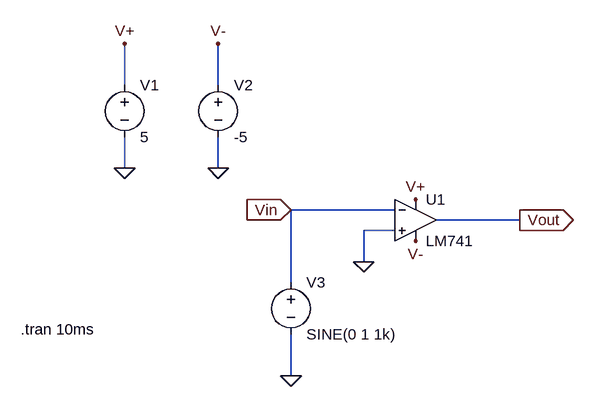
[diagram p0: schematic OPAmp-1.asc]
OPAmp-1.asc, the LTspice schematic file:
Version 4
SHEET 1 880 680
WIRE 48 144 48 80
WIRE 192 144 192 80
WIRE 48 272 48 224
WIRE 192 272 192 224
WIRE 464 336 304 336
WIRE 656 352 528 352
WIRE 464 368 416 368
WIRE 416 416 416 368
WIRE 304 448 304 336
WIRE 304 592 304 528
FLAG 48 272 0
FLAG 192 272 0
FLAG 304 336 Vin
IOPIN 304 336 In
FLAG 416 416 0
FLAG 304 592 0
FLAG 656 352 Vout
IOPIN 656 352 Out
FLAG 496 320 V+
FLAG 496 384 V-
FLAG 192 80 V-
FLAG 48 80 V+
SYMBOL LM741 496 288 R0
SYMATTR InstName U1
SYMBOL voltage 48 128 R0
SYMATTR InstName V1
SYMATTR Value 5
SYMBOL voltage 192 128 R0
SYMATTR InstName V2
SYMATTR Value -5
SYMBOL Voltage 304 432 R0
SYMATTR InstName V3
SYMATTR Value SINE(0 1 1k)
TEXT -112 520 Left 2 !.tran 10ms

The netlist it stands for:
* OPAmp-1.asc
XU1 0 Vin V+ V- Vout LM741  ; pins In+ In- V+ V- OUT
V1 V+ 0 5
V2 V- 0 -5
V3 Vin 0 SINE(0 1 1k)
.tran 10ms
.lib LM741.lib
.backanno
.end